# Altium schematic sheet display-lcd-16x2.SchDoc
size A4
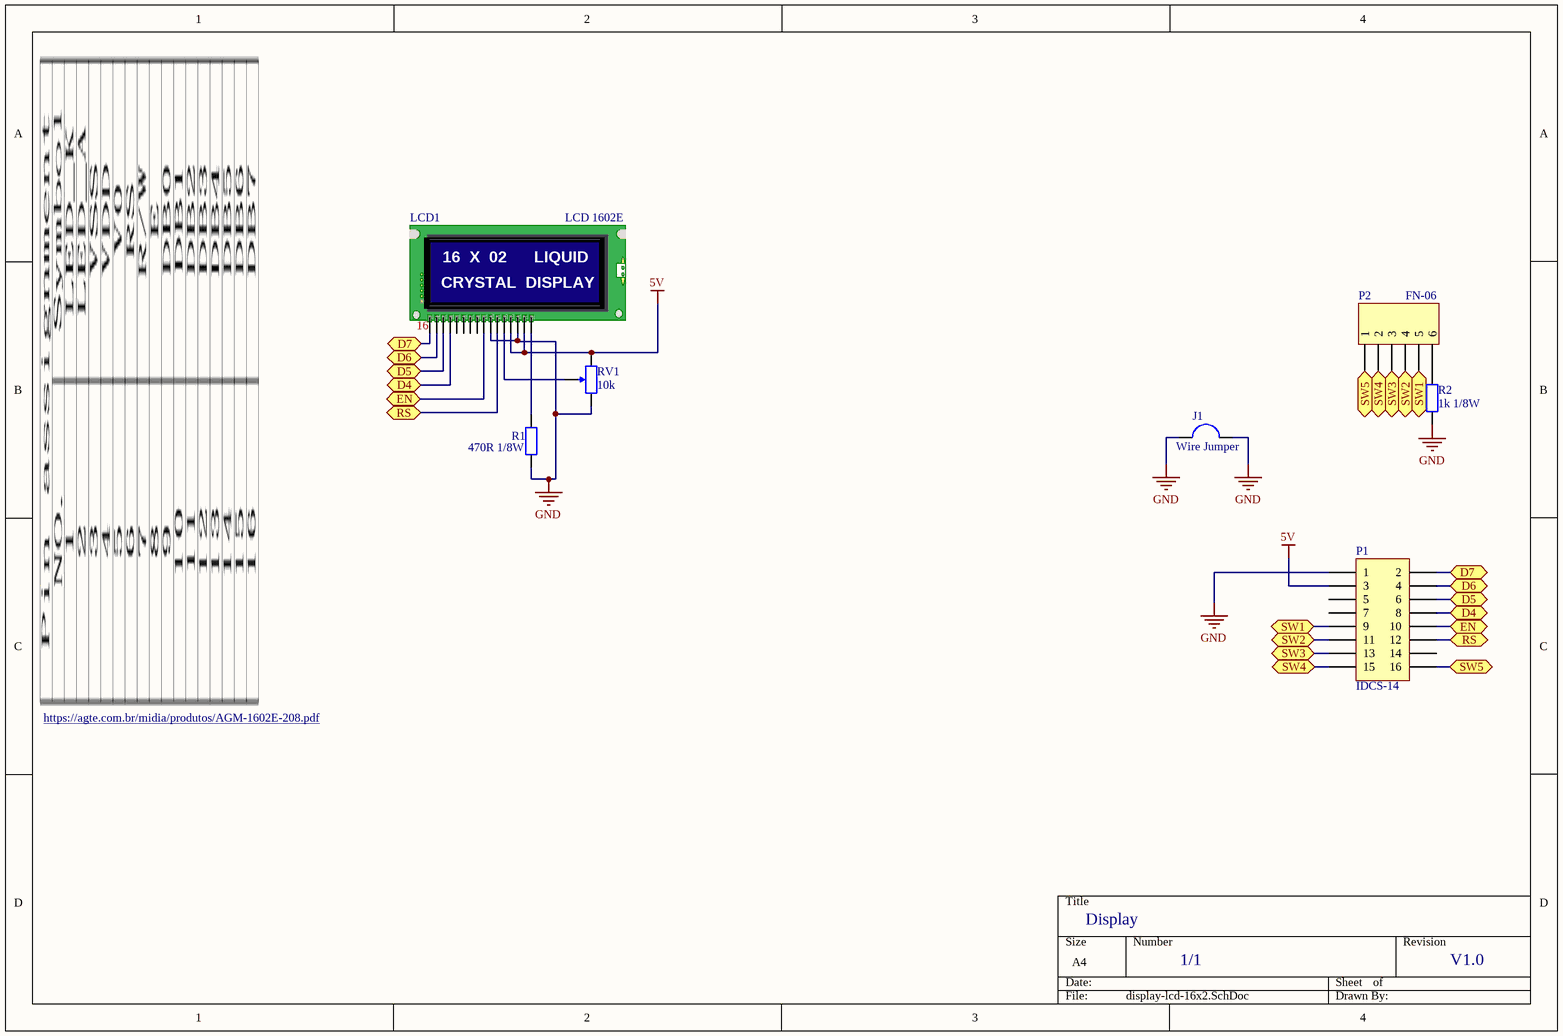
[diagram p0: display-lcd-16x2.SchDoc]

## Parts
J1  Wire Jumper  [JUMPER CR16]
LCD1  LCD 1602E  [LCD1602B]
P1  IDCS-14  [IDCSC-16]
P2  FN-06  [FN-06]
R1  470R 1/8W  [RESISTOR_CR16]
R2  1k 1/8W  [RES CR16]
RV1  10k  [3296W]

## Ports
D4, D5, D6, D7, EN, RS, SW1, SW2, SW3, SW4, SW5

## Nets
5V: LCD1.2 LCD1.15 P1.3 RV1.1(TOP)
GND: J1.1 J1.2 LCD1.1 LCD1.5 P1.1 R1.1 R2.1 RV1.3(BOT)
D4: LCD1.11 P1.8 ; port D4
D5: LCD1.12 P1.6 ; port D5
D6: LCD1.13 P1.4 ; port D6
D7: LCD1.14 P1.2 ; port D7
EN: LCD1.6 P1.10 ; port EN
RS: LCD1.4 P1.12 ; port RS
SW1: P1.9 P2.5 ; port SW1
SW2: P1.11 P2.4 ; port SW2
SW3: P1.13 P2.3 ; port SW3
SW4: P1.15 P2.2 ; port SW4
SW5: P1.16 P2.1 ; port SW5
NetLCD1_3: LCD1.3 RV1.2(TAP)
NetLCD1_16: LCD1.16 R1.2
NetP2_6: P2.6 R2.2

Not connected (* = marked no-connect by the designer): LCD1 7 8 9 10; P1 5 7 14

## Notes on the sheet
- (near LCD1) 16
- https://agte.com.br/midia/produtos/AGM-1602E-208.pdf
- Display
- 1/1
- V1.0
- (in symbol LCD 1602 Azul) 16  X  02      LIQUID; CRYSTAL  DISPLAY; D7; D6; D5; D4; D3; D2; D1; D0; EN; RW; RS; VO; VD; VS

## Library data of the parts
J1 = Jumper CR16: JUMPER 7,62MM; Manufacturer: Stackpole Electronics Inc.; Manufacturer Part Number: JW60ZT0R00; Código: 162; Montagem: PTH; Supplier 1: Digi-Key; Supplier Part Number 1: JW60ZT0R00TR-ND; RoHS: RoHS Compliant; Category: Resistors; Stock 1: 560000; Pricing 1: 10000=0.00396, 30000=0.00348, 50000=0.00319, 100000=0.00313 (USD); Packaging: Tape & Reel (TR); Part Status: Active; Tolerance: Jumper; Power (Watts): -; Composition: Metal Element; Features: -; Temperature Coefficient: -; Operating Temperature: -55°C ~ 155°C; Package / Case: -; Supplier Device Package: -; Size / Dimension: -; Height - Seated (Max): -; Failure Rate: -; ComponentLink1URL: http://www.seielect.com/catalog/SEI-JW.pdf; ComponentLink1Description: http://www.seielect.com/catalog/SEI-JW.pdf
LCD1 = LCD 1602 Azul: LCD ALPHA/NUM DISPL 16X2 BLU/WHT; Manufacturer: AGTechonogies; Part Number: AGM 1602B-802; DesignBy: Rogerio Regel; DataRevisao: 19/05/2015
P1 = Header 8X2: Header, 8-Pin, Dual row; LatestRevisionDate: 17-Jul-2002; LatestRevisionNote: Re-released for DXP Platform.; Publisher: Altium Limited
P2 = Conector para PCI flexível: CONN FFC FPC TOP 6POS 2.54MM R/A; Manufacturer: TE Connectivity AMP Connectors; Manufacturer Part Number: 5-520314-6; Flat Flex Type: FFC, FPC; Connector/Contact Type: Contacts, Top; Number of Positions: 6; Pitch: 0.100" (2.54mm); FFC, FCB Thickness: 0.13mm ~ 0.38mm; Cable End Type: Straight; Voltage Rating: 250V; Material Flammability Rating: UL94 V-0; Current Rating: 1A; Supplier 1: Digi-Key; Supplier Part Number 1: 5-520314-6-ND; RoHS: RoHS Compliant; Category: Connectors, Interconnects; Stock 1: 1802; Pricing 1: 1=0.79, 25=0.7132, 100=0.61, 500=0.511, 1000=0.455, 2000=0.422 (USD); Packaging: Bulk; Mounting Type: Through Hole, Right Angle; Termination: Kinked Pin; Height Above Board: 0.190" (4.83mm); Locking Feature: -; Contact Material: Phosphor Bronze; Contact Finish: Tin; Housing Material: Polyester Thermoplastic, Glass Filled; Actuator Material: -; Features: -; Operating Temperature: -55°C ~ 105°C; ComponentLink1URL: http://www.te.com/commerce/DocumentDelivery/DDEController?Action=srchrtrv&DocNm=520314&DocType=Customer+Drawing&DocLang=English; ComponentLink1Description: http://www.te.com/commerce/DocumentDelivery/DDEController?Action=srchrtrv&DocNm=520314&DocType=Customer+Drawing&DocLang=English
R1 = Res 470R 1/8W 5%: RES 470 OHM 1/8W 5% CF AXIAL CARBON FILM; Manufacturer: Stackpole Electronics Inc; Manufacturer Part Number: CF18JT470R; Power (Watts): 0.125W, 1/8W; Temperature Coefficient: 0/ -400ppm/°C; Resistance (Ohms): 470; Supplier 1: Digi-Key; Supplier Part Number 1: CF18JT470RCT-ND; RoHS: RoHS Compliant; Category: Resistors; Stock 1: 9872; Pricing 1: 1=0.1, 10=0.065, 50=0.0356, 100=0.0271, 250=0.02016, 500=0.01488, 1000=0.00992, 2500=0.00837 (USD); Packaging: Cut Tape (CT); Tolerance: ±5%; Composition: Carbon Film; Features: Flame Retardant Coating, Moisture Resistant, Safety; Operating Temperature: -55°C ~ 155°C; Package / Case: Axial; Supplier Device Package: Axial; Size / Dimension: 0.067" Dia x 0.130" L (1.70mm x 3.30mm); ComponentLink1URL: http://www.seielect.com/catalog/SEI-CF_CFM.pdf; ComponentLink1Description: http://www.seielect.com/catalog/SEI-CF_CFM.pdf; Height: -; Number of Terminations: 2
R2 = Res 1k 1/8W 5% CR16: RES 1k OHM 1/8W 5% AXIAL; Manufacturer: Stackpole Electronics Inc.; Manufacturer Part Number: CF18JT1K00; Montagem: PTH; Código: 256; Power (Watts): 0.125W, 1/8W; Temperature Coefficient: 0/ -400ppm/°C; Supplier 1: Digi-Key; Supplier Part Number 1: CF18JT1K00CT-ND; RoHS: RoHS Compliant; Category: Resistors; Stock 1: 791230; Pricing 1: 1=0.1, 10=0.049, 25=0.036, 50=0.0272, 100=0.0201, 250=0.01536, 500=0.01228, 1000=0.00904 (USD); Packaging: Cut Tape (CT); Part Status: Active; Tolerance: ±5%; Composition: Carbon Film; Features: Flame Retardant Coating, Safety; Operating Temperature: -55°C ~ 155°C; Package / Case: Axial; Supplier Device Package: Axial; Size / Dimension: 0.067" Dia x 0.130" L (1.70mm x 3.30mm); Height - Seated (Max): -; Failure Rate: -; ComponentLink1URL: https://www.seielect.com/Catalog/SEI-CF_CFM.pdf; ComponentLink1Description: https://www.seielect.com/Catalog/SEI-CF_CFM.pdf
RV1 = Trimmer 3296W-1-103LF: Manufacturer: Bourns Inc.; Manufacturer Part Number: 3386F-1-202LF; Resistance (Ohms): 2k; Power (Watts): 0.5W, 1/2W; Tolerance: ±10%; Temperature Coefficient: ±100ppm/°C; Number of Turns: Single; Adjustment Type: Top Adjustment; Resistive Material: Cermet; Supplier 1: Digi-Key; Supplier Part Number 1: 3386F-202LF-ND; RoHS: RoHS Compliant; Category: Potentiometers, Variable Resistors; Stock 1: 6040; Pricing 1: 1=1.6, 10=1.41, 25=1.2692, 50=1.222, 100=1.175, 250=1.10452, 500=0.94, 1000=0.8695, 2500=0.752 (USD); Packaging: Tube; Mounting Type: Through Hole; Termination Style: PC Pin; Size / Dimension: Square - 0.375" x 0.375" Face x 0.190" H (9.53mm x 9.53mm x 4.83mm); ComponentLink1URL: http://www.bourns.com/docs/Product-Datasheets/3386.pdf; ComponentLink1Description: http://www.bourns.com/docs/Product-Datasheets/3386.pdf